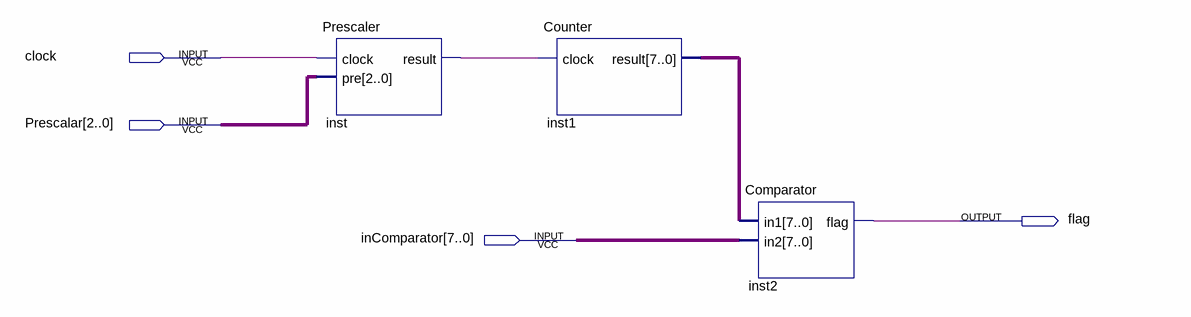
[diagram p0: schematic sheet]
// Quartus schematic Timer.bdf as structural Verilog: 3 symbols, 4 pins
module Timer (
  input  clock,
  input  [2:0] Prescalar,
  input  [7:0] inComparator,
  output flag
);

  wire inst_result;
  wire [7:0] inst1_result;

  Prescaler inst (.clock(clock), .pre(Prescalar), .result(inst_result));
  Counter inst1 (.clock(inst_result), .result(inst1_result));
  Comparator inst2 (.in1(inst1_result), .in2(inComparator), .flag(flag));
endmodule
